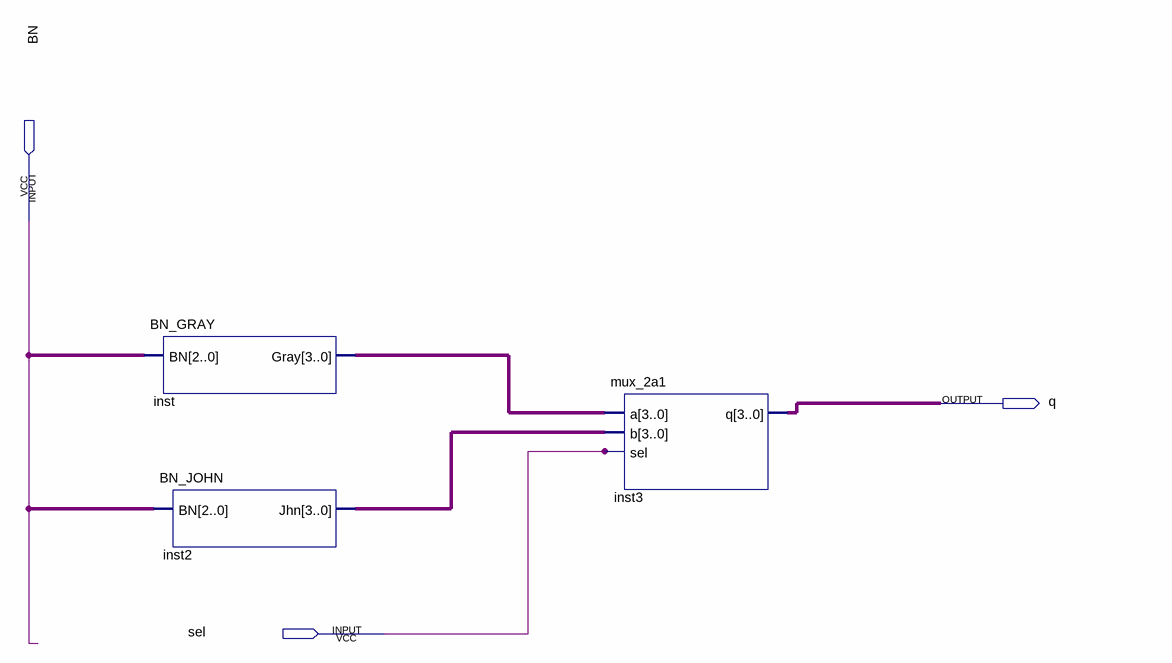
[diagram p0: schematic sheet]
// Quartus schematic Block1.bdf as structural Verilog: 3 symbols, 3 pins
module Block1 (
  input  BN,
  input  sel,
  output q
);

  wire [2:0] undriven, undriven_2;
  wire [3:0] inst2_jhn, inst3_q, inst_gray;

  BN_GRAY inst (.BN(undriven), .Gray(inst_gray));
  BN_JOHN inst2 (.BN(undriven_2), .Jhn(inst2_jhn));
  mux_2a1 inst3 (.a(inst_gray), .b(inst2_jhn), .sel(sel), .q(inst3_q));
endmodule
